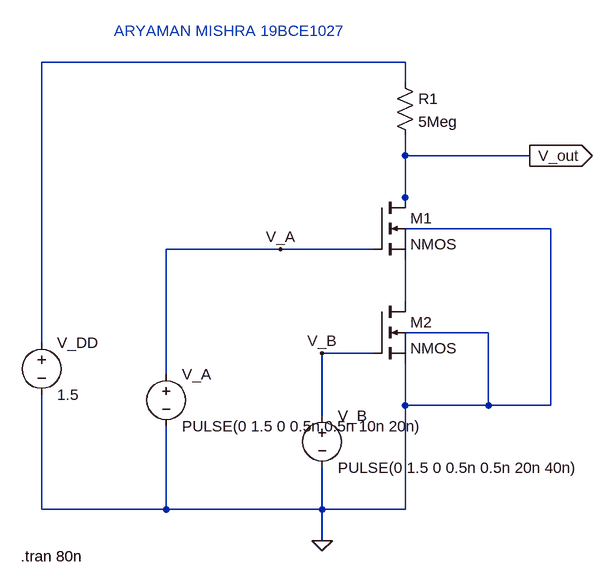
[diagram p0: schematic task7_21 (1).asc]
task7_21 (1).asc, the LTspice schematic file:
Version 4
SHEET 1 916 680
WIRE 560 -384 0 -384
WIRE 560 -352 560 -384
WIRE 560 -240 560 -272
WIRE 752 -240 560 -240
WIRE 560 -176 560 -240
WIRE 560 -160 560 -176
WIRE 784 -128 560 -128
WIRE 368 -96 192 -96
WIRE 512 -96 368 -96
WIRE 560 -16 560 -80
WIRE 688 32 560 32
WIRE 0 48 0 -384
WIRE 512 64 432 64
WIRE 192 96 192 -96
WIRE 560 144 560 80
WIRE 688 144 688 32
WIRE 688 144 560 144
WIRE 784 144 784 -128
WIRE 784 144 688 144
WIRE 432 160 432 64
WIRE 0 304 0 128
WIRE 192 304 192 176
WIRE 192 304 0 304
WIRE 432 304 432 240
WIRE 432 304 192 304
WIRE 560 304 560 144
WIRE 560 304 432 304
WIRE 432 352 432 304
FLAG 752 -240 V_out
IOPIN 752 -240 Out
FLAG 368 -96 V_A
FLAG 432 64 V_B
FLAG 432 352 0
SYMBOL voltage 0 32 R0
WINDOW 123 0 0 Left 0
WINDOW 39 0 0 Left 0
SYMATTR InstName V_DD
SYMATTR Value 1.5
SYMBOL voltage 192 80 R0
WINDOW 123 0 0 Left 0
WINDOW 39 0 0 Left 0
SYMATTR InstName V_A
SYMATTR Value PULSE(0 1.5 0 0.5n 0.5n 10n 20n)
SYMBOL voltage 432 144 R0
WINDOW 123 0 0 Left 0
WINDOW 39 0 0 Left 0
SYMATTR InstName V_B
SYMATTR Value PULSE(0 1.5 0 0.5n 0.5n 20n 40n)
SYMBOL nmos 512 -176 R0
SYMATTR InstName M1
SYMBOL nmos 512 -16 R0
SYMATTR InstName M2
SYMBOL res 544 -368 R0
SYMATTR InstName R1
SYMATTR Value 5Meg
TEXT -32 376 Left 2 !.tran 80n
TEXT 112 -432 Left 2 ;ARYAMAN MISHRA 19BCE1027

The netlist it stands for:
* task7_21 (1).asc
V_DD N001 0 1.5
V_A V_A 0 PULSE(0 1.5 0 0.5n 0.5n 10n 20n)
V_B V_B 0 PULSE(0 1.5 0 0.5n 0.5n 20n 40n)
M1 V_out V_A N002 N002 NMOS
M2 N002 V_B 0 0 NMOS
R1 N001 V_out 5Meg
.model NMOS NMOS
.model PMOS PMOS
.lib standard.mos
.tran 80n
* ARYAMAN MISHRA 19BCE1027
.backanno
.end

* Results of the author's LTspice run, read from the files saved beside the schematic
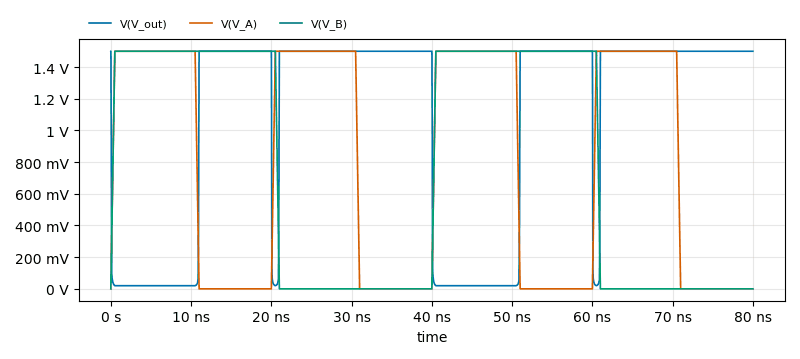
[diagram p1: Transient Analysis of task7_21 (1).asc, plotted from the saved traces]
* Transient Analysis, 1 run:
*   V(V_out): min 19.87 mV, max 1.5 V, average 1.064 V, rms 1.259 V, last 1.5 V
*   V(V_A): min 0 V, max 1.5 V, average 787.5 mV, rms 1.079 V, last 0 V
*   V(V_B): min 0 V, max 1.5 V, average 768.7 mV, rms 1.07 V, last 0 V